# EAGLE schematic PCB_6 (EAGLE 9.6.2)
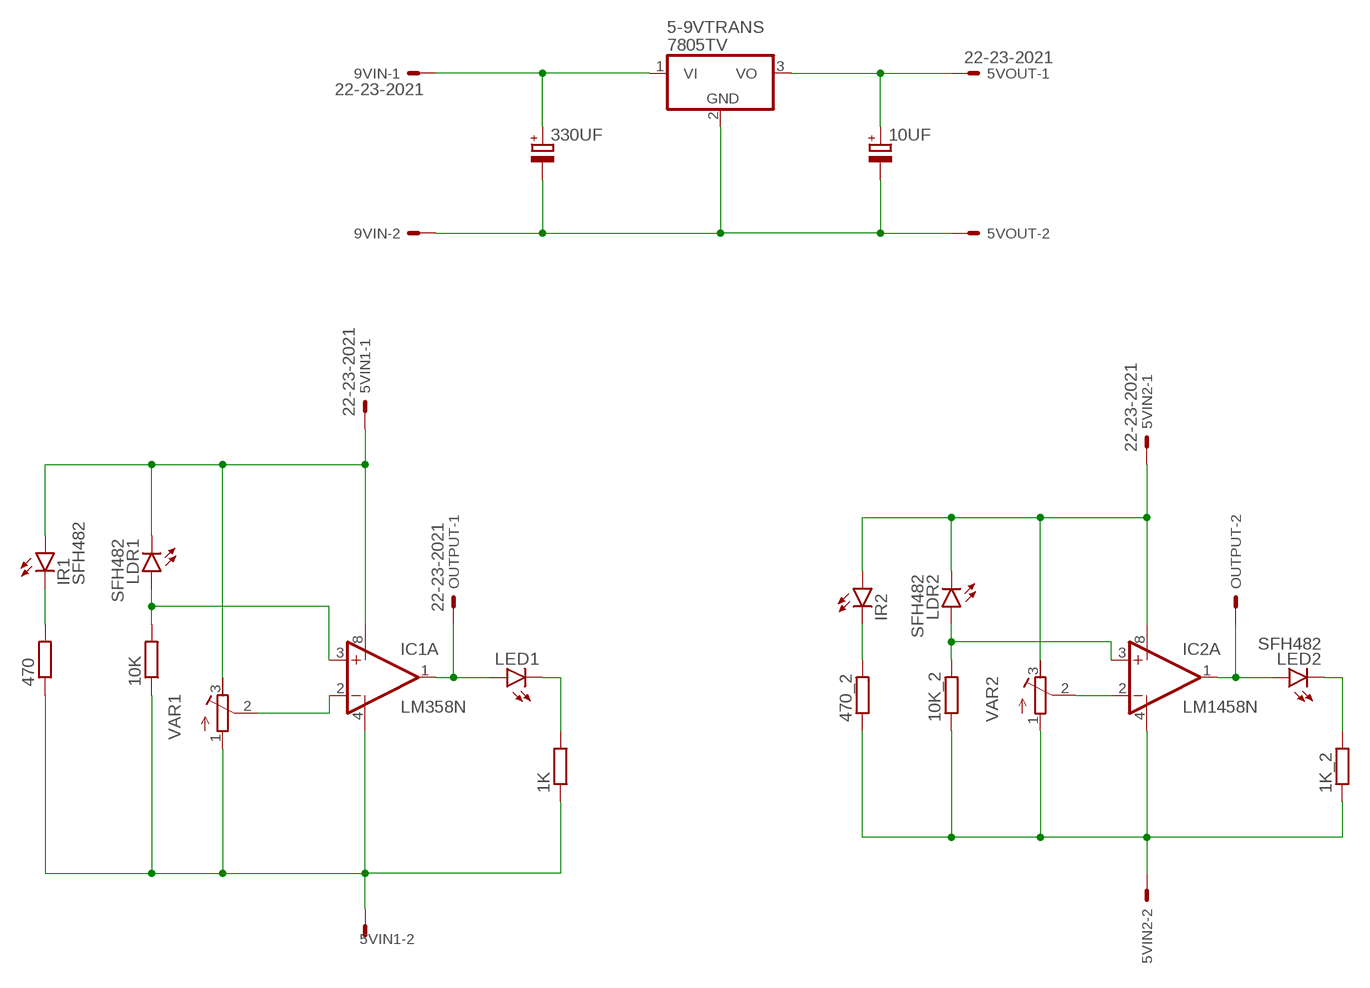
[diagram p0: schematic, sheet 1]

## Parts
1K  R-EU_0207/10  [0207/10]
1K_2  R-EU_0207/10  [0207/10]
5-9VTRANS  7805TV  [TO220V]
5VIN1  22-23-2021  [22-23-2021]
5VIN2  22-23-2021  [22-23-2021]
5VOUT  22-23-2021  [22-23-2021]
9VIN  22-23-2021  [22-23-2021]
10K  R-EU_0207/10  [0207/10]
10K_2  R-EU_0207/10  [0207/10]
10UF  CPOL-EUE1.8-4  [E1,8-4]
330UF  CPOL-EUE2,5-6E  [E2,5-6E]
470  R-EU_0207/10  [0207/10]
470_2  R-EU_0207/10  [0207/10]
IC1  LM358N  [DIL08]
IC2  LM1458N  [DIL08]
IR1  SFH482  [SFH482]
IR2  LEDSFH480  [SFH480]
LDR1  SFH482  [SFH482]
LDR2  SFH482  [SFH482]
LED1  LEDSFH480  [SFH480]
LED2  SFH482  [SFH482]
OUTPUT  22-23-2021  [22-23-2021]
VAR1  R-TRIMM64W  [RTRIM64W]
VAR2  R-TRIMM64W  [RTRIM64W]

## Nets
+5: 5-9VTRANS.3(VO) 5VOUT.1 10UF.+
GND: 5-9VTRANS.2(GND) 5VOUT.2 9VIN.2 10UF.- 330UF.-
N$1: 1K.1 5VIN1.2 10K.1 470.1 IC1.4(P:V-) VAR1.1(A)
N$2: 1K.2 LED1.K(C)
N$3: IC1.2(A:-IN) VAR1.2(S)
N$4: 10K.2 IC1.3(A:+IN) LDR1.A
N$5: 470.2 IR1.K(C)
N$6: 5VIN1.1 IC1.8(P:V+) IR1.A LDR1.K(C) VAR1.3(E)
N$7: 5VIN2.1 IC2.8(P:V+) IR2.A LDR2.K(C) VAR2.3(E)
N$8: 10K_2.2 IC2.3(A:+IN) LDR2.A
N$9: IC1.1(A:OUT) LED1.A OUTPUT.1
N$10: IC2.2(A:-IN) VAR2.2(S)
N$11: 470_2.2 IR2.K(C)
N$12: IC2.1(A:OUT) LED2.A OUTPUT.2
N$13: 1K_2.2 LED2.K(C)
N$14: 1K_2.1 5VIN2.2 10K_2.1 470_2.1 IC2.4(P:V-) VAR2.1(A)
N$15: 5-9VTRANS.1(VI) 9VIN.1 330UF.+
Unconnected: IC1.5(B:+IN) IC1.6(B:-IN) IC1.7(B:OUT) IC2.5(B:+IN) IC2.6(B:-IN) IC2.7(B:OUT)

## Library data of the parts
1K 1K_2 10K 10K_2 470 470_2 = rcl:R-EU_: RESISTOR, European symbol; SPICEPREFIX: R
5-9VTRANS = linear:78*: Positive VOLTAGE REGULATOR Source: http://cache.national.com/ds/LM/LM78L05.pdf http://www.fairchildsemi.com/ds/LM/LM7805.pdf
5VIN1 5VIN2 5VOUT 9VIN OUTPUT = con-molex:22-23-2021: .100" (2.54mm) Center Header - 2 Pin; MF: MOLEX; MPN: 22-23-2021; OC_FARNELL: 1462926; OC_NEWARK: 25C3832
10UF 330UF = rcl:CPOL-EU: POLARIZED CAPACITOR, European symbol; SPICEPREFIX: C
IC1 = linear:LM358: OP AMP also LM158; LM258; LM2904 Source: http://cache.national.com/ds/LM/LM158.pdf
IC2 = linear:*1458: OP AMP
IR1 LDR1 LDR2 LED2 = led:SFH482: IR LED infrared emitting diode, Infineon
IR2 LED1 = led:LED: LED OSRAM: - CHIPLED LG R971, LG N971, LY N971, LG Q971, LY Q971, LO R971, LY R971 LH N974, LH R974 LS Q976, LO Q976, LY Q976 LO Q996 - Hyper CHIPLED LW Q18S LB Q993, LB Q99A, LB R99A - SideLED LS A670, LO A670, LY A670, LG A670, LP A670 LB A673, LV A673, LT A673, LW A673 LH A674 LY A675 LS A676, LA A676, LO A676, LY A676, LW A676 LS A679, LY A679, LG A679 - Hyper Micro SIDELED® LS Y876, LA Y876, LO Y876, LY Y876 LT Y87S - SmartLED LW L88C, LW L88S LB L89C, LB L89S, LG L890 LS L89K, LO L89K, LY L89K LS L896, LA L896, LO L896, LY L896 - TOPLED LS T670, LO T670, LY T670, LG T670, LP T670 LSG T670, LSP T670, LSY T670, LOP T670, LYG T670 LG T671, LOG T671, LSG T671 LB T673, LV T673, LT T673, LW T673 LH T674 LS T676, LA T676, LO T676, LY T676, LB T676, LH T676, LSB T676, LW T676 LB T67C, LV T67C, LT T67C, LS T67K, LO T67K, LY T67K, LW E67C LS E67B, LA E67B, LO E67B, LY E67B, LB E67C, LV E67C, LT E67C LW T67C LS T679, LY T679, LG T679 LS T770, LO T770, LY T770, LG T770, LP T770 LB T773, LV T773, LT T773, LW T773 LH T774 LS E675, LA E675, LY E675, LS T675 LS T776, LA T776, LO T776, LY T776, LB T776 LHGB T686 LT T68C, LB T68C - Hyper Mini TOPLED® LB M676 - Mini TOPLED Santana® LG M470 LS M47K, LO M47K, LY M47K Source: http://www.osram.convergy.de LUXEON: - LUMILED® LXK2-PW12-R00, LXK2-PW12-S00, LXK2-PW14-U00, LXK2-PW14-V00 LXK2-PM12-R00, LXK2-PM12-S00, LXK2-PM14-U00 LXK2-PE12-Q00, LXK2-PE12-R00, LXK2-PE12-S00, LXK2-PE14-T00, LXK2-PE14-U00 LXK2-PB12-K00, LXK2-PB12-L00, LXK2-PB12-M00, LXK2-PB14-N00, LXK2-PB14-P00, LXK2-PB14-Q00 LXK2-PR12-L00, LXK2-PR12-M00, LXK2-PR14-Q00, LXK2-PR14-R00 LXK2-PD12-Q00, LXK2-PD12-R00, LXK2-PD12-S00 LXK2-PH12-R00, LXK2-PH12-S00 LXK2-PL12-P00, LXK2-PL12-Q00, LXK2-PL12-R00 Source: www.luxeon.com KINGBRIGHT: KA-3528ASYC Source: www.kingbright.com
VAR1 VAR2 = rcl:R-TRIMM: Trimm resistor; SPICEMODEL: X; SPICEPREFIXL: POT